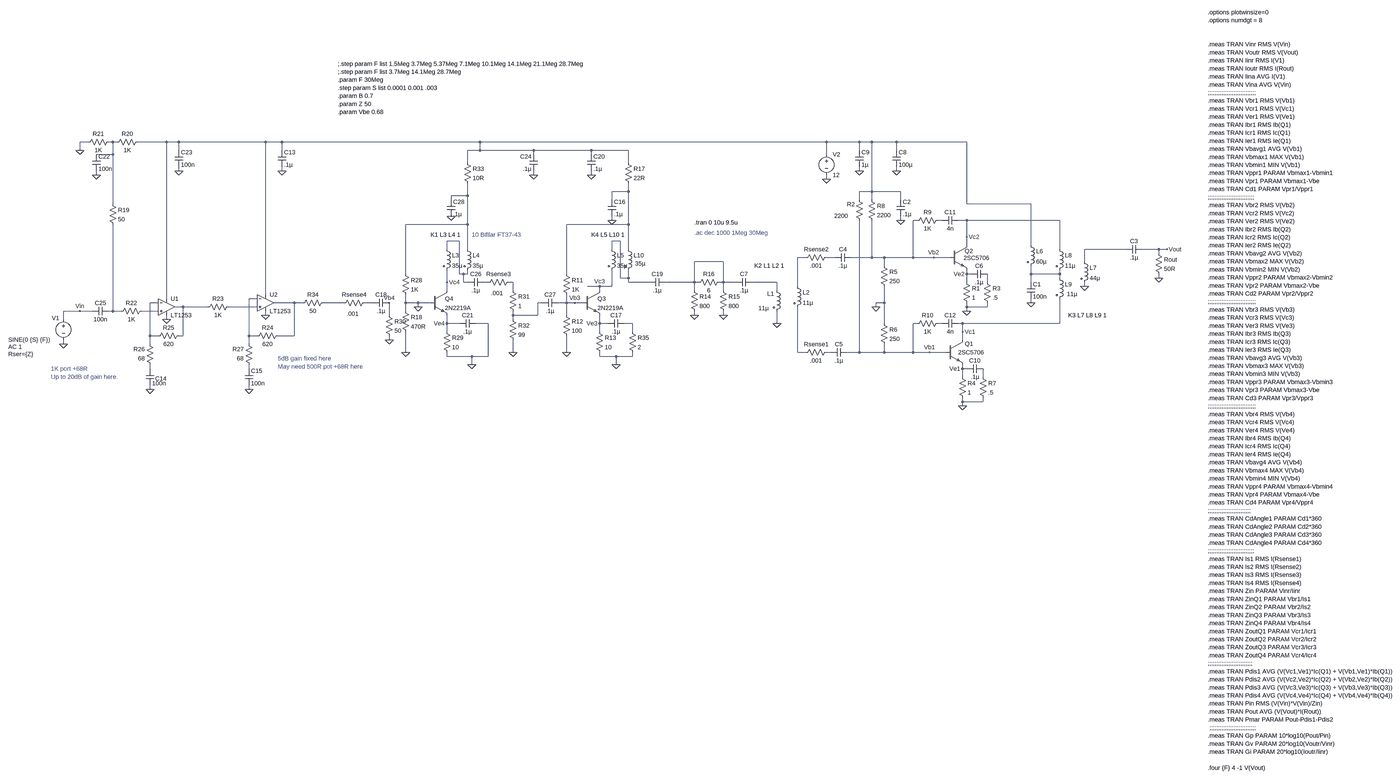
[diagram p0: schematic LT1253+2N3904+2n2219+SC5706 Push-Pull testing.asc, whole sheet]
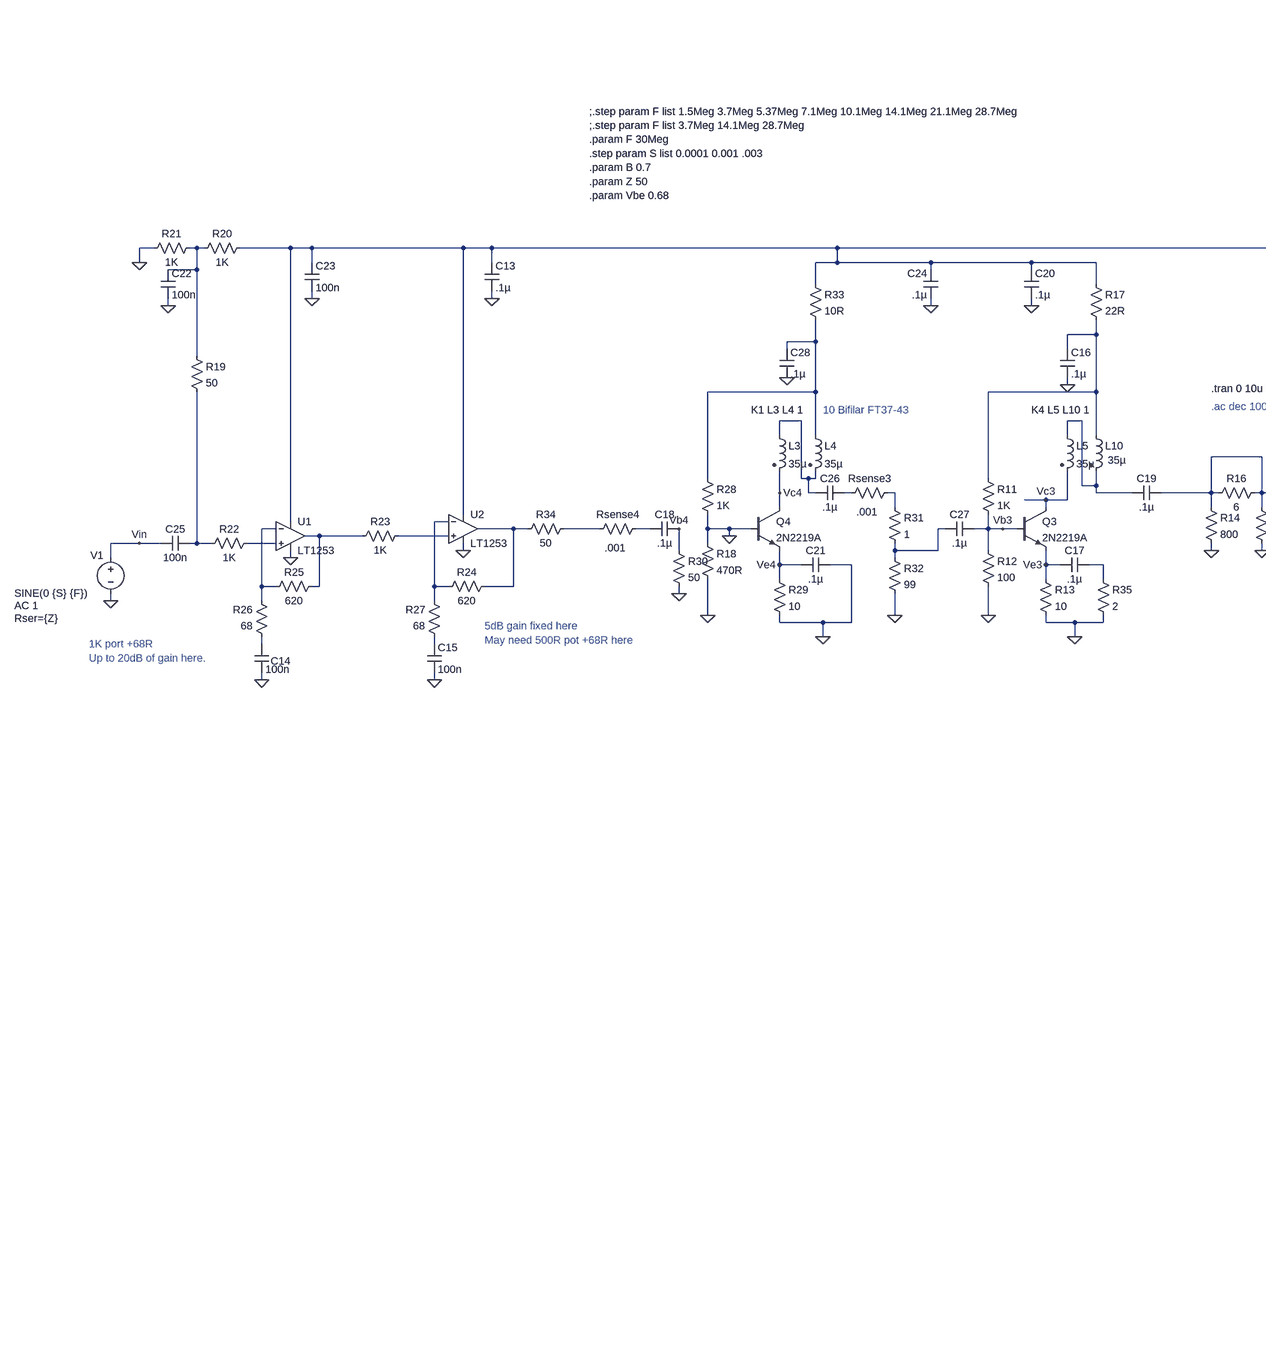
[diagram p1: schematic LT1253+2N3904+2n2219+SC5706 Push-Pull testing.asc, part, row 1 of 1, column 1 of 2]
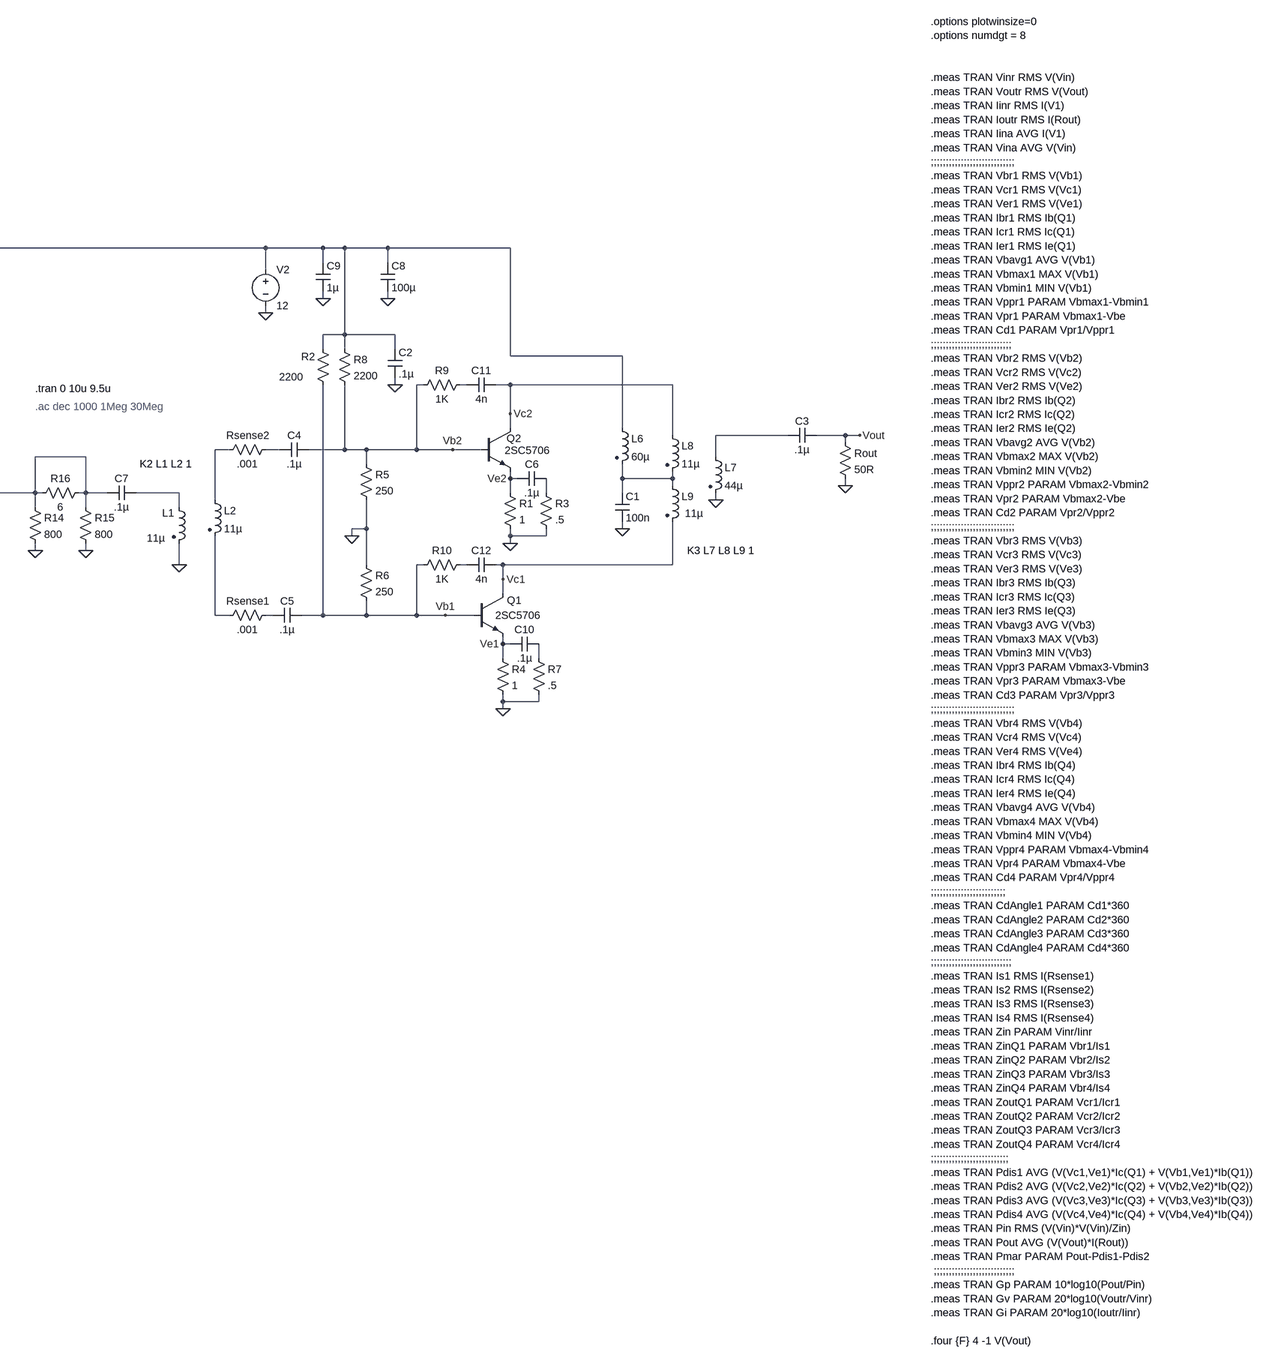
[diagram p2: schematic LT1253+2N3904+2n2219+SC5706 Push-Pull testing.asc, part, row 1 of 1, column 2 of 2]
LT1253+2N3904+2n2219+SC5706 Push-Pull testing.asc, the LTspice schematic file:
Version 4
SHEET 1 3748 1520
WIRE -2704 -624 -2736 -624
WIRE -2608 -624 -2624 -624
WIRE -2592 -624 -2608 -624
WIRE -2400 -624 -2512 -624
WIRE -2352 -624 -2400 -624
WIRE -2016 -624 -2352 -624
WIRE -1952 -624 -2016 -624
WIRE -1184 -624 -1952 -624
WIRE 160 -624 -1184 -624
WIRE 288 -624 160 -624
WIRE 336 -624 288 -624
WIRE 432 -624 336 -624
WIRE 704 -624 432 -624
WIRE -2736 -592 -2736 -624
WIRE -2352 -592 -2352 -624
WIRE -1952 -592 -1952 -624
WIRE -1184 -592 -1184 -624
WIRE -1184 -592 -1232 -592
WIRE -976 -592 -1184 -592
WIRE -752 -592 -976 -592
WIRE -608 -592 -752 -592
WIRE 288 -592 288 -624
WIRE 432 -592 432 -624
WIRE -2608 -576 -2608 -624
WIRE -2608 -576 -2672 -576
WIRE -976 -576 -976 -592
WIRE -752 -576 -752 -592
WIRE 160 -576 160 -624
WIRE -1232 -544 -1232 -592
WIRE -608 -544 -608 -592
WIRE -2352 -512 -2352 -528
WIRE -1952 -512 -1952 -528
WIRE 288 -512 288 -528
WIRE 432 -512 432 -528
WIRE -2672 -496 -2672 -512
WIRE -976 -496 -976 -512
WIRE -752 -496 -752 -512
WIRE 160 -480 160 -496
WIRE -608 -432 -608 -464
WIRE -608 -432 -672 -432
WIRE 336 -432 336 -624
WIRE 336 -432 288 -432
WIRE 448 -432 336 -432
WIRE -1232 -416 -1232 -464
WIRE -1232 -416 -1296 -416
WIRE -1296 -400 -1296 -416
WIRE -672 -400 -672 -432
WIRE 288 -400 288 -432
WIRE 336 -400 336 -432
WIRE 448 -400 448 -432
WIRE -2608 -384 -2608 -576
WIRE 704 -384 704 -624
WIRE 960 -384 704 -384
WIRE -672 -320 -672 -336
WIRE 448 -320 448 -336
WIRE 512 -320 496 -320
WIRE 608 -320 592 -320
WIRE 704 -320 672 -320
WIRE 1072 -320 704 -320
WIRE -1232 -304 -1232 -416
WIRE -1232 -304 -1472 -304
WIRE -608 -304 -608 -432
WIRE -608 -304 -848 -304
WIRE 704 -256 704 -320
WIRE -1264 -240 -1312 -240
WIRE -640 -240 -672 -240
WIRE 704 -224 704 -256
WIRE 960 -224 960 -384
WIRE -1312 -208 -1312 -240
WIRE -1232 -208 -1232 -304
WIRE -672 -208 -672 -240
WIRE -608 -208 -608 -304
WIRE 1072 -208 1072 -320
WIRE 1328 -208 1168 -208
WIRE 1456 -208 1392 -208
WIRE 1488 -208 1456 -208
WIRE 1456 -192 1456 -208
WIRE 80 -176 48 -176
WIRE 192 -176 160 -176
WIRE 336 -176 336 -320
WIRE 336 -176 256 -176
WIRE 384 -176 336 -176
WIRE 496 -176 496 -320
WIRE 496 -176 384 -176
WIRE 576 -176 496 -176
WIRE 640 -176 576 -176
WIRE -240 -160 -352 -160
WIRE 1168 -160 1168 -208
WIRE 384 -144 384 -176
WIRE -1472 -112 -1472 -304
WIRE -1264 -112 -1264 -240
WIRE -1248 -112 -1264 -112
WIRE -1232 -112 -1232 -128
WIRE -1232 -112 -1248 -112
WIRE -848 -112 -848 -304
WIRE 704 -112 704 -128
WIRE 720 -112 704 -112
WIRE 960 -112 960 -144
WIRE 1072 -112 1072 -128
WIRE 1072 -112 960 -112
WIRE -640 -96 -640 -240
WIRE -608 -96 -608 -128
WIRE -608 -96 -640 -96
WIRE 1072 -96 1072 -112
WIRE 1456 -96 1456 -112
WIRE -1312 -80 -1312 -128
WIRE -1248 -80 -1248 -112
WIRE -1232 -80 -1248 -80
WIRE -1152 -80 -1168 -80
WIRE -1056 -80 -1072 -80
WIRE -608 -80 -608 -96
WIRE -528 -80 -608 -80
WIRE -352 -80 -352 -160
WIRE -352 -80 -464 -80
WIRE -336 -80 -352 -80
WIRE -240 -80 -240 -160
WIRE -240 -80 -256 -80
WIRE -192 -80 -240 -80
WIRE -32 -80 -128 -80
WIRE 704 -80 704 -112
WIRE 784 -80 784 -112
WIRE 960 -80 960 -112
WIRE -720 -64 -768 -64
WIRE -672 -64 -672 -128
WIRE -672 -64 -720 -64
WIRE 48 -64 48 -176
WIRE 1168 -64 1168 -80
WIRE -1312 -48 -1312 -80
WIRE -1056 -48 -1056 -80
WIRE -720 -48 -720 -64
WIRE -352 -48 -352 -80
WIRE -240 -48 -240 -80
WIRE -32 -48 -32 -80
WIRE -2016 -32 -2016 -624
WIRE -2400 -16 -2400 -624
WIRE -2048 -16 -2080 -16
WIRE -2432 0 -2464 0
WIRE -1904 0 -1984 0
WIRE -1872 0 -1904 0
WIRE -1712 0 -1792 0
WIRE -1600 0 -1632 0
WIRE -1472 0 -1472 -32
WIRE -1424 0 -1472 0
WIRE -1376 0 -1424 0
WIRE -944 0 -960 0
WIRE -848 0 -848 -32
WIRE -848 0 -880 0
WIRE -816 0 -848 0
WIRE -784 0 -816 0
WIRE 384 0 384 -64
WIRE 384 0 352 0
WIRE 960 0 960 -16
WIRE -2336 16 -2368 16
WIRE -2240 16 -2336 16
WIRE -2048 16 -2160 16
WIRE -1424 16 -1424 0
WIRE 352 16 352 0
WIRE 704 16 704 0
WIRE 784 16 784 0
WIRE 784 16 704 16
WIRE -2736 32 -2800 32
WIRE -2688 32 -2736 32
WIRE -2608 32 -2608 -304
WIRE -2608 32 -2624 32
WIRE -2576 32 -2608 32
WIRE -2432 32 -2496 32
WIRE -1472 32 -1472 0
WIRE 704 32 704 16
WIRE -2016 48 -2016 32
WIRE -1536 48 -1536 0
WIRE -1056 48 -1056 32
WIRE -960 48 -960 0
WIRE -960 48 -1056 48
WIRE -848 48 -848 0
WIRE -352 48 -352 32
WIRE -240 48 -240 32
WIRE -2800 64 -2800 32
WIRE -2400 64 -2400 48
WIRE -1056 64 -1056 48
WIRE -1312 80 -1312 48
WIRE -1264 80 -1312 80
WIRE -1152 80 -1200 80
WIRE -720 80 -720 48
WIRE -688 80 -720 80
WIRE -592 80 -624 80
WIRE -32 80 -32 32
WIRE 384 80 384 0
WIRE 512 80 496 80
WIRE 608 80 592 80
WIRE 688 80 672 80
WIRE 1072 80 1072 -16
WIRE 1072 80 688 80
WIRE -1312 112 -1312 80
WIRE -720 112 -720 80
WIRE -592 112 -592 80
WIRE 688 112 688 80
WIRE -2464 128 -2464 0
WIRE -2432 128 -2464 128
WIRE -2336 128 -2336 16
WIRE -2336 128 -2352 128
WIRE -2080 128 -2080 -16
WIRE -2048 128 -2080 128
WIRE -1904 128 -1904 0
WIRE -1904 128 -1968 128
WIRE -1536 144 -1536 128
WIRE 688 144 688 112
WIRE -2800 160 -2800 144
WIRE -2464 160 -2464 128
WIRE -2080 160 -2080 128
WIRE -1472 192 -1472 112
WIRE -1056 192 -1056 144
WIRE -848 192 -848 128
WIRE 48 192 48 16
WIRE 80 192 48 192
WIRE 176 192 160 192
WIRE 288 192 288 -320
WIRE 288 192 240 192
WIRE 384 192 384 160
WIRE 384 192 288 192
WIRE 496 192 496 80
WIRE 496 192 384 192
WIRE 560 192 496 192
WIRE 624 192 560 192
WIRE -1312 208 -1312 192
WIRE -1216 208 -1312 208
WIRE -1152 208 -1152 80
WIRE -1152 208 -1216 208
WIRE -720 208 -720 192
WIRE -656 208 -720 208
WIRE -592 208 -592 192
WIRE -592 208 -656 208
WIRE -1216 240 -1216 208
WIRE -656 240 -656 208
WIRE -2464 256 -2464 240
WIRE -2080 256 -2080 240
WIRE 688 256 688 240
WIRE 704 256 688 256
WIRE 688 288 688 256
WIRE 768 288 768 256
WIRE -2464 336 -2464 320
WIRE -2080 336 -2080 320
WIRE 688 384 688 368
WIRE 768 384 768 368
WIRE 768 384 688 384
WIRE 688 400 688 384
FLAG 160 -480 0
FLAG -2800 160 0
FLAG 688 400 0
FLAG 1488 -208 Vout
FLAG 1456 -96 0
FLAG 560 192 Vb1
FLAG 688 256 Ve1
FLAG -2736 32 Vin
FLAG 688 112 Vc1
FLAG 704 32 0
FLAG 576 -176 Vb2
FLAG 704 -112 Ve2
FLAG 704 -256 Vc2
FLAG -32 80 0
FLAG 352 16 0
FLAG 960 0 0
FLAG 448 -320 0
FLAG 288 -512 0
FLAG 1168 -64 0
FLAG 432 -512 0
FLAG -1952 -512 0
FLAG -352 48 0
FLAG -240 48 0
FLAG -2352 -512 0
FLAG -2672 -496 0
FLAG -2400 64 0
FLAG -2016 48 0
FLAG -2080 336 0
FLAG -2736 -592 0
FLAG -2464 336 0
FLAG -848 192 0
FLAG -672 -320 0
FLAG -752 -496 0
FLAG -976 -496 0
FLAG -1216 240 0
FLAG -1472 192 0
FLAG -1056 192 0
FLAG -1296 -336 0
FLAG -816 0 Vb3
FLAG -1536 0 Vb4
FLAG -720 -64 Vc3
FLAG -720 80 Ve3
FLAG -1312 -80 Vc4
FLAG -1312 80 Ve4
FLAG -656 240 0
FLAG -1536 144 0
FLAG -1424 16 0
SYMBOL npn 624 144 R0
WINDOW 0 73 15 Left 2
WINDOW 3 47 48 Left 2
SYMATTR InstName Q1
SYMATTR Value 2SC5706
SYMBOL voltage -2800 48 R0
WINDOW 0 -45 11 Left 2
WINDOW 3 -214 95 Left 2
WINDOW 123 -214 123 Left 2
WINDOW 39 -214 151 Left 2
SYMATTR InstName V1
SYMATTR Value SINE(0 {S} {F})
SYMATTR Value2 AC 1
SYMATTR SpiceLine Rser={Z}
SYMBOL voltage 160 -592 R0
WINDOW 123 0 0 Left 0
WINDOW 39 0 0 Left 0
SYMATTR InstName V2
SYMATTR Value 12
SYMBOL res 672 272 R0
SYMATTR InstName R4
SYMATTR Value 1
SYMBOL cap 1392 -224 R90
WINDOW 0 0 32 VBottom 2
WINDOW 3 32 32 VTop 2
SYMATTR InstName C3
SYMATTR Value .1µ
SYMBOL res 1440 -208 R0
SYMATTR InstName Rout
SYMATTR Value 50R
SYMBOL cap -128 -96 R90
WINDOW 0 0 32 VBottom 2
WINDOW 3 32 32 VTop 2
SYMATTR InstName C7
SYMATTR Value .1µ
SYMBOL npn 640 -224 R0
WINDOW 0 56 23 Left 2
WINDOW 3 52 50 Left 2
SYMATTR InstName Q2
SYMATTR Value 2SC5706
SYMBOL res 688 -96 R0
SYMATTR InstName R1
SYMATTR Value 1
SYMBOL ind2 -48 -64 R0
WINDOW 0 -22 29 Left 2
WINDOW 3 -56 85 Left 2
SYMATTR InstName L1
SYMATTR Value 11µ
SYMATTR Type ind
SYMBOL ind2 32 -80 R0
SYMATTR InstName L2
SYMATTR Value 11µ
SYMATTR Type ind
SYMBOL res 320 -416 R0
SYMATTR InstName R8
SYMATTR Value 2200
SYMBOL res 368 -160 R0
SYMATTR InstName R5
SYMATTR Value 250
SYMBOL res 368 64 R0
SYMATTR InstName R6
SYMATTR Value 250
SYMBOL ind2 1056 -224 R0
SYMATTR InstName L8
SYMATTR Value 11µ
SYMATTR Type ind
SYMBOL ind2 1056 -112 R0
WINDOW 3 43 78 Left 2
SYMATTR Value 11µ
SYMATTR InstName L9
SYMATTR Type ind
SYMBOL ind2 1152 -176 R0
SYMATTR InstName L7
SYMATTR Value 44µ
SYMATTR Type ind
SYMBOL ind2 944 -240 R0
SYMATTR InstName L6
SYMATTR Value 60µ
SYMATTR Type ind
SYMBOL cap 944 -80 R0
SYMATTR InstName C1
SYMATTR Value 100n
SYMBOL cap 432 -400 R0
SYMATTR InstName C2
SYMATTR Value .1µ
SYMBOL cap 272 -592 R0
SYMATTR InstName C9
SYMATTR Value 1µ
SYMBOL res 272 -416 R0
WINDOW 0 -33 33 Left 2
WINDOW 3 -82 78 Left 2
SYMATTR InstName R2
SYMATTR Value 2200
SYMBOL cap 416 -592 R0
SYMATTR InstName C8
SYMATTR Value 100µ
SYMBOL res 176 -192 R90
WINDOW 0 0 56 VBottom 2
WINDOW 3 32 56 VTop 2
SYMATTR InstName Rsense2
SYMATTR Value .001
SYMBOL res 176 176 R90
WINDOW 0 0 56 VBottom 2
WINDOW 3 32 56 VTop 2
SYMATTR InstName Rsense1
SYMATTR Value .001
SYMBOL cap 256 -192 R90
WINDOW 0 0 32 VBottom 2
WINDOW 3 32 32 VTop 2
SYMATTR InstName C4
SYMATTR Value .1µ
SYMBOL cap 240 176 R90
WINDOW 0 0 32 VBottom 2
WINDOW 3 32 32 VTop 2
SYMATTR InstName C5
SYMATTR Value .1µ
SYMBOL cap 784 -128 R90
WINDOW 0 0 32 VBottom 2
WINDOW 3 32 32 VTop 2
SYMATTR InstName C6
SYMATTR Value .1µ
SYMBOL cap 768 240 R90
WINDOW 0 0 32 VBottom 2
WINDOW 3 32 32 VTop 2
SYMATTR InstName C10
SYMATTR Value .1µ
SYMBOL res 768 -96 R0
SYMATTR InstName R3
SYMATTR Value .5
SYMBOL res 752 272 R0
SYMATTR InstName R7
SYMATTR Value .5
SYMBOL cap 672 -336 R90
WINDOW 0 0 32 VBottom 2
WINDOW 3 32 32 VTop 2
SYMATTR InstName C11
SYMATTR Value 4n
SYMBOL res 608 -336 R90
WINDOW 0 0 56 VBottom 2
WINDOW 3 32 56 VTop 2
SYMATTR InstName R9
SYMATTR Value 1K
SYMBOL cap 672 64 R90
WINDOW 0 0 32 VBottom 2
WINDOW 3 32 32 VTop 2
SYMATTR InstName C12
SYMATTR Value 4n
SYMBOL res 608 64 R90
WINDOW 0 0 56 VBottom 2
WINDOW 3 32 56 VTop 2
SYMATTR InstName R10
SYMATTR Value 1K
SYMBOL cap -1968 -592 R0
SYMATTR InstName C13
SYMATTR Value .1µ
SYMBOL res -368 -64 R0
SYMATTR InstName R14
SYMATTR Value 800
SYMBOL res -256 -64 R0
SYMATTR InstName R15
SYMATTR Value 800
SYMBOL res -240 -96 R90
WINDOW 0 0 56 VBottom 2
WINDOW 3 32 56 VTop 2
SYMATTR InstName R16
SYMATTR Value 6
SYMBOL cap -464 -96 R90
WINDOW 0 0 32 VBottom 2
WINDOW 3 32 32 VTop 2
SYMATTR InstName C19
SYMATTR Value .1µ
SYMBOL Opamps\\LT1253 -2400 -48 R0
SYMATTR InstName U1
SYMBOL Opamps\\LT1253 -2016 -64 R0
SYMATTR InstName U2
SYMBOL res -2624 -400 R0
SYMATTR InstName R19
SYMATTR Value 50
SYMBOL res -2496 -640 R90
WINDOW 0 0 56 VBottom 2
WINDOW 3 32 56 VTop 2
SYMATTR InstName R20
SYMATTR Value 1K
SYMBOL res -2608 -640 R90
WINDOW 0 0 56 VBottom 2
WINDOW 3 32 56 VTop 2
SYMATTR InstName R21
SYMATTR Value 1K
SYMBOL res -2480 16 R90
WINDOW 0 0 56 VBottom 2
WINDOW 3 32 56 VTop 2
SYMATTR InstName R22
SYMATTR Value 1K
SYMBOL res -2144 0 R90
WINDOW 0 0 56 VBottom 2
WINDOW 3 32 56 VTop 2
SYMATTR InstName R23
SYMATTR Value 1K
SYMBOL res -1952 112 R90
WINDOW 0 0 56 VBottom 2
WINDOW 3 32 56 VTop 2
SYMATTR InstName R24
SYMATTR Value 620
SYMBOL res -2336 112 R90
WINDOW 0 0 56 VBottom 2
WINDOW 3 32 56 VTop 2
SYMATTR InstName R25
SYMATTR Value 620
SYMBOL res -2448 256 R180
WINDOW 0 36 76 Left 2
WINDOW 3 36 40 Left 2
SYMATTR InstName R26
SYMATTR Value 68
SYMBOL res -2064 256 R180
WINDOW 0 36 76 Left 2
WINDOW 3 36 40 Left 2
SYMATTR InstName R27
SYMATTR Value 68
SYMBOL cap -2480 256 R0
WINDOW 0 36 38 Left 2
SYMATTR InstName C14
SYMATTR Value 100n
SYMBOL cap -2096 256 R0
SYMATTR InstName C15
SYMATTR Value 100n
SYMBOL cap -2688 -576 R0
SYMATTR InstName C22
SYMATTR Value 100n
SYMBOL cap -2368 -592 R0
SYMATTR InstName C23
SYMATTR Value 100n
SYMBOL cap -2624 16 R90
WINDOW 0 0 32 VBottom 2
WINDOW 3 32 32 VTop 2
SYMATTR InstName C25
SYMATTR Value 100n
SYMBOL res -1056 -96 R90
WINDOW 0 0 56 VBottom 2
WINDOW 3 43 62 VTop 2
SYMATTR InstName Rsense3
SYMATTR Value .001
SYMBOL npn -784 -48 R0
SYMATTR InstName Q3
SYMATTR Value 2N2219A
SYMBOL res -864 -128 R0
SYMATTR InstName R11
SYMATTR Value 1K
SYMBOL res -864 32 R0
SYMATTR InstName R12
SYMATTR Value 100
SYMBOL res -736 96 R0
SYMATTR InstName R13
SYMATTR Value 10
SYMBOL ind2 -1328 -224 R0
SYMATTR InstName L3
SYMATTR Value 35µ
SYMATTR Type ind
SYMBOL ind2 -1248 -224 R0
SYMATTR InstName L4
SYMATTR Value 35µ
SYMATTR Type ind
SYMBOL res -624 -560 R0
SYMATTR InstName R17
SYMATTR Value 22R
SYMBOL cap -688 -400 R0
SYMATTR InstName C16
SYMATTR Value .1µ
SYMBOL cap -1536 -16 R90
WINDOW 0 0 32 VBottom 2
WINDOW 3 32 32 VTop 2
SYMATTR InstName C18
SYMATTR Value .1µ
SYMBOL ind2 -688 -224 R0
SYMATTR InstName L5
SYMATTR Value 35µ
SYMATTR Type ind
SYMBOL ind2 -624 -224 R0
WINDOW 3 42 71 Left 2
SYMATTR Value 35µ
SYMATTR InstName L10
SYMATTR Type ind
SYMBOL cap -768 -576 R0
SYMATTR InstName C20
SYMATTR Value .1µ
SYMBOL npn -1376 -48 R0
SYMATTR InstName Q4
SYMATTR Value 2N2219A
SYMBOL res -1488 16 R0
SYMATTR InstName R18
SYMATTR Value 470R
SYMBOL res -1488 -128 R0
SYMATTR InstName R28
SYMATTR Value 1K
SYMBOL res -1328 96 R0
SYMATTR InstName R29
SYMATTR Value 10
SYMBOL cap -1200 64 R90
WINDOW 0 0 32 VBottom 2
WINDOW 3 32 32 VTop 2
SYMATTR InstName C21
SYMATTR Value .1µ
SYMBOL cap -960 -512 R180
WINDOW 0 24 56 Left 2
WINDOW 3 24 8 Left 2
SYMATTR InstName C24
SYMATTR Value .1µ
SYMBOL cap -1232 -64 R270
WINDOW 0 32 32 VTop 2
WINDOW 3 0 32 VBottom 2
SYMATTR InstName C26
SYMATTR Value .1µ
SYMBOL res -1072 -64 R0
SYMATTR InstName R31
SYMATTR Value 1
SYMBOL res -1072 48 R0
SYMATTR InstName R32
SYMATTR Value 99
SYMBOL res -1248 -560 R0
SYMATTR InstName R33
SYMATTR Value 10R
SYMBOL cap -944 16 R270
WINDOW 0 32 32 VTop 2
WINDOW 3 0 32 VBottom 2
SYMATTR InstName C27
SYMATTR Value .1µ
SYMBOL cap -1312 -400 R0
SYMATTR InstName C28
SYMATTR Value .1µ
SYMBOL res -1776 -16 R90
WINDOW 0 0 56 VBottom 2
WINDOW 3 32 56 VTop 2
SYMATTR InstName R34
SYMATTR Value 50
SYMBOL res -608 96 R0
SYMATTR InstName R35
SYMATTR Value 2
SYMBOL cap -624 64 R90
WINDOW 0 0 32 VBottom 2
WINDOW 3 32 32 VTop 2
SYMATTR InstName C17
SYMATTR Value .1µ
SYMBOL res -1616 -16 R90
WINDOW 0 0 56 VBottom 2
WINDOW 3 43 62 VTop 2
SYMATTR InstName Rsense4
SYMATTR Value .001
SYMBOL res -1552 32 R0
SYMATTR InstName R30
SYMATTR Value 50
TEXT -352 -312 Left 2 !.tran 0 10u 9.5u
TEXT 1864 -1128 Left 2 !.options plotwinsize=0\n.options numdgt = 8\n \n \n.meas TRAN Vinr RMS V(Vin)\n.meas TRAN Voutr RMS V(Vout)\n.meas TRAN Iinr RMS I(V1)\n.meas TRAN Ioutr RMS I(Rout)\n.meas TRAN Iina AVG I(V1)\n.meas TRAN Vina AVG V(Vin)\n;;;;;;;;;;;;;;;;;;;;;;;;;;;;\n.meas TRAN Vbr1 RMS V(Vb1)\n.meas TRAN Vcr1 RMS V(Vc1)\n.meas TRAN Ver1 RMS V(Ve1)\n.meas TRAN Ibr1 RMS Ib(Q1)\n.meas TRAN Icr1 RMS Ic(Q1)\n.meas TRAN Ier1 RMS Ie(Q1)\n.meas TRAN Vbavg1 AVG V(Vb1)\n.meas TRAN Vbmax1 MAX V(Vb1)\n.meas TRAN Vbmin1 MIN V(Vb1)\n.meas TRAN Vppr1 PARAM Vbmax1-Vbmin1\n.meas TRAN Vpr1 PARAM Vbmax1-Vbe\n.meas TRAN Cd1 PARAM Vpr1/Vppr1\n;;;;;;;;;;;;;;;;;;;;;;;;;;;\n.meas TRAN Vbr2 RMS V(Vb2)\n.meas TRAN Vcr2 RMS V(Vc2)\n.meas TRAN Ver2 RMS V(Ve2)\n.meas TRAN Ibr2 RMS Ib(Q2)\n.meas TRAN Icr2 RMS Ic(Q2)\n.meas TRAN Ier2 RMS Ie(Q2)\n.meas TRAN Vbavg2 AVG V(Vb2)\n.meas TRAN Vbmax2 MAX V(Vb2)\n.meas TRAN Vbmin2 MIN V(Vb2)\n.meas TRAN Vppr2 PARAM Vbmax2-Vbmin2\n.meas TRAN Vpr2 PARAM Vbmax2-Vbe\n.meas TRAN Cd2 PARAM Vpr2/Vppr2\n;;;;;;;;;;;;;;;;;;;;;;;;;;;;\n.meas TRAN Vbr3 RMS V(Vb3)\n.meas TRAN Vcr3 RMS V(Vc3)\n.meas TRAN Ver3 RMS V(Ve3)\n.meas TRAN Ibr3 RMS Ib(Q3)\n.meas TRAN Icr3 RMS Ic(Q3)\n.meas TRAN Ier3 RMS Ie(Q3)\n.meas TRAN Vbavg3 AVG V(Vb3)\n.meas TRAN Vbmax3 MAX V(Vb3)\n.meas TRAN Vbmin3 MIN V(Vb3)\n.meas TRAN Vppr3 PARAM Vbmax3-Vbmin3\n.meas TRAN Vpr3 PARAM Vbmax3-Vbe\n.meas TRAN Cd3 PARAM Vpr3/Vppr3\n;;;;;;;;;;;;;;;;;;;;;;;;;;;;\n.meas TRAN Vbr4 RMS V(Vb4)\n.meas TRAN Vcr4 RMS V(Vc4)\n.meas TRAN Ver4 RMS V(Ve4)\n.meas TRAN Ibr4 RMS Ib(Q4)\n.meas TRAN Icr4 RMS Ic(Q4)\n.meas TRAN Ier4 RMS Ie(Q4)\n.meas TRAN Vbavg4 AVG V(Vb4)\n.meas TRAN Vbmax4 MAX V(Vb4)\n.meas TRAN Vbmin4 MIN V(Vb4)\n.meas TRAN Vppr4 PARAM Vbmax4-Vbmin4\n.meas TRAN Vpr4 PARAM Vbmax4-Vbe\n.meas TRAN Cd4 PARAM Vpr4/Vppr4\n;;;;;;;;;;;;;;;;;;;;;;;;;\n.meas TRAN CdAngle1 PARAM Cd1*360\n.meas TRAN CdAngle2 PARAM Cd2*360\n.meas TRAN CdAngle3 PARAM Cd3*360\n.meas TRAN CdAngle4 PARAM Cd4*360\n;;;;;;;;;;;;;;;;;;;;;;;;;;;\n.meas TRAN Is1 RMS I(Rsense1)\n.meas TRAN Is2 RMS I(Rsense2)\n.meas TRAN Is3 RMS I(Rsense3)\n.meas TRAN Is4 RMS I(Rsense4)\n.meas TRAN Zin PARAM Vinr/Iinr\n.meas TRAN ZinQ1 PARAM Vbr1/Is1\n.meas TRAN ZinQ2 PARAM Vbr2/Is2 \n.meas TRAN ZinQ3 PARAM Vbr3/Is3 \n.meas TRAN ZinQ4 PARAM Vbr4/Is4 \n.meas TRAN ZoutQ1 PARAM Vcr1/Icr1\n.meas TRAN ZoutQ2 PARAM Vcr2/Icr2\n.meas TRAN ZoutQ3 PARAM Vcr3/Icr3\n.meas TRAN ZoutQ4 PARAM Vcr4/Icr4\n;;;;;;;;;;;;;;;;;;;;;;;;;;\n.meas TRAN Pdis1 AVG (V(Vc1,Ve1)*Ic(Q1) + V(Vb1,Ve1)*Ib(Q1))\n.meas TRAN Pdis2 AVG (V(Vc2,Ve2)*Ic(Q2) + V(Vb2,Ve2)*Ib(Q2))\n.meas TRAN Pdis3 AVG (V(Vc3,Ve3)*Ic(Q3) + V(Vb3,Ve3)*Ib(Q3))\n.meas TRAN Pdis4 AVG (V(Vc4,Ve4)*Ic(Q4) + V(Vb4,Ve4)*Ib(Q4))\n.meas TRAN Pin RMS (V(Vin)*V(Vin)/Zin)\n.meas TRAN Pout AVG (V(Vout)*I(Rout))\n.meas TRAN Pmar PARAM Pout-Pdis1-Pdis2\n ;;;;;;;;;;;;;;;;;;;;;;;;;;;\n.meas TRAN Gp PARAM 10*log10(Pout/Pin)\n.meas TRAN Gv PARAM 20*log10(Voutr/Vinr)\n.meas TRAN Gi PARAM 20*log10(Ioutr/Iinr)\n \n.four {F} 4 -1 V(Vout)
TEXT -1736 -928 Left 2 !;.step param F list 1.5Meg 3.7Meg 5.37Meg 7.1Meg 10.1Meg 14.1Meg 21.1Meg 28.7Meg\n;.step param F list 3.7Meg 14.1Meg 28.7Meg\n.param F 30Meg\n.step param S list 0.0001 0.001 .003\n.param B 0.7\n.param Z 50\n.param Vbe 0.68
TEXT -352 -272 Left 2 ;.ac dec 1000 1Meg 30Meg
TEXT 1104 48 Left 2 !K3 L7 L8 L9 1
TEXT -120 -144 Left 2 !K2 L1 L2 1
TEXT -1968 216 Left 2 ;5dB gain fixed here\nMay need 500R pot +68R here
TEXT -2848 256 Left 2 ;1K port +68R  \nUp to 20dB of gain here.
TEXT -1376 -264 Left 2 !K1 L3 L4 1
TEXT -752 -264 Left 2 !K4 L5 L10 1
TEXT -1216 -264 Left 2 ;10 Bifilar FT37-43

The netlist it stands for:
* LT1253+2N3904+2n2219+SC5706 Push-Pull testing.asc
Q1 Vc1 Vb1 Ve1 0 2SC5706
V1 Vin 0 SINE(0 {S} {F}) AC 1 Rser={Z}
V2 N002 0 12
R4 Ve1 0 1
C3 Vout N008 .1µ
Rout Vout 0 50R
C7 N015 N011 .1µ
Q2 Vc2 Vb2 Ve2 0 2SC5706
R1 Ve2 0 1
L1 N015 0 11µ
L2 N009 N029 11µ
R8 N002 Vb2 2200
R5 Vb2 0 250
R6 0 Vb1 250
L8 Vc2 N012 11µ
L9 N012 Vc1 11µ
L7 N008 0 44µ
L6 N002 N012 60µ
C1 N012 0 100n
C2 N002 0 .1µ
C9 N002 0 1µ
R2 N002 Vb1 2200
C8 N002 0 100µ
Rsense2 N010 N009 .001
Rsense1 N030 N029 .001
C4 Vb2 N010 .1µ
C5 Vb1 N030 .1µ
C6 N016 Ve2 .1µ
C10 N033 Ve1 .1µ
R3 N016 0 .5
R7 N033 0 .5
C11 Vc2 N005 4n
R9 N005 Vb2 1K
C12 Vc1 N028 4n
R10 N028 Vb1 1K
C13 N002 0 .1µ
R14 N011 0 800
R15 N011 0 800
R16 N011 N011 6
C19 N011 N007 .1µ
XU1 N026 N018 N002 0 N023 LT1253  ; pins In+ In- V+ V- OUT
XU2 N024 N017 N002 0 N019 LT1253  ; pins In+ In- V+ V- OUT
R19 N001 N025 50
R20 N002 N001 1K
R21 N001 0 1K
R22 N026 N025 1K
R23 N024 N023 1K
R24 N019 N017 620
R25 N023 N018 620
R26 N031 N018 68
R27 N032 N017 68
C14 N031 0 100n
C15 N032 0 100n
C22 N001 0 100n
C23 N002 0 100n
C25 N025 Vin 100n
Rsense3 N014 N013 .001
Q3 Vc3 Vb3 Ve3 0 2N2219A
R11 N003 Vb3 1K
R12 Vb3 0 100
R13 Ve3 0 10
L3 N006 Vc4 35µ
L4 N004 N006 35µ
R17 N002 N003 22R
C16 N003 0 .1µ
C18 Vb4 N021 .1µ
L5 N007 Vc3 35µ
L10 N003 N007 35µ
C20 N002 0 .1µ
Q4 Vc4 0 Ve4 0 2N2219A
R18 0 0 470R
R28 N004 0 1K
R29 Ve4 0 10
C21 0 Ve4 .1µ
C24 0 N002 .1µ
C26 N006 N013 .1µ
R31 N014 N022 1
R32 N022 0 99
R33 N002 N004 10R
C27 N022 Vb3 .1µ
C28 N004 0 .1µ
R34 N020 N019 50
R35 N027 0 2
C17 N027 Ve3 .1µ
Rsense4 N021 N020 .001
R30 Vb4 0 50
.model NPN NPN
.model PNP PNP
.lib standard.bjt
.tran 0 10u 9.5u
.options plotwinsize=0
.options numdgt = 8
.meas TRAN Vinr RMS V(Vin)
.meas TRAN Voutr RMS V(Vout)
.meas TRAN Iinr RMS I(V1)
.meas TRAN Ioutr RMS I(Rout)
.meas TRAN Iina AVG I(V1)
.meas TRAN Vina AVG V(Vin)
;;;;;;;;;;;;;;;;;;;;;;;;;;;;
.meas TRAN Vbr1 RMS V(Vb1)
.meas TRAN Vcr1 RMS V(Vc1)
.meas TRAN Ver1 RMS V(Ve1)
.meas TRAN Ibr1 RMS Ib(Q1)
.meas TRAN Icr1 RMS Ic(Q1)
.meas TRAN Ier1 RMS Ie(Q1)
.meas TRAN Vbavg1 AVG V(Vb1)
.meas TRAN Vbmax1 MAX V(Vb1)
.meas TRAN Vbmin1 MIN V(Vb1)
.meas TRAN Vppr1 PARAM Vbmax1-Vbmin1
.meas TRAN Vpr1 PARAM Vbmax1-Vbe
.meas TRAN Cd1 PARAM Vpr1/Vppr1
;;;;;;;;;;;;;;;;;;;;;;;;;;;
.meas TRAN Vbr2 RMS V(Vb2)
.meas TRAN Vcr2 RMS V(Vc2)
.meas TRAN Ver2 RMS V(Ve2)
.meas TRAN Ibr2 RMS Ib(Q2)
.meas TRAN Icr2 RMS Ic(Q2)
.meas TRAN Ier2 RMS Ie(Q2)
.meas TRAN Vbavg2 AVG V(Vb2)
.meas TRAN Vbmax2 MAX V(Vb2)
.meas TRAN Vbmin2 MIN V(Vb2)
.meas TRAN Vppr2 PARAM Vbmax2-Vbmin2
.meas TRAN Vpr2 PARAM Vbmax2-Vbe
.meas TRAN Cd2 PARAM Vpr2/Vppr2
;;;;;;;;;;;;;;;;;;;;;;;;;;;;
.meas TRAN Vbr3 RMS V(Vb3)
.meas TRAN Vcr3 RMS V(Vc3)
.meas TRAN Ver3 RMS V(Ve3)
.meas TRAN Ibr3 RMS Ib(Q3)
.meas TRAN Icr3 RMS Ic(Q3)
.meas TRAN Ier3 RMS Ie(Q3)
.meas TRAN Vbavg3 AVG V(Vb3)
.meas TRAN Vbmax3 MAX V(Vb3)
.meas TRAN Vbmin3 MIN V(Vb3)
.meas TRAN Vppr3 PARAM Vbmax3-Vbmin3
.meas TRAN Vpr3 PARAM Vbmax3-Vbe
.meas TRAN Cd3 PARAM Vpr3/Vppr3
;;;;;;;;;;;;;;;;;;;;;;;;;;;;
.meas TRAN Vbr4 RMS V(Vb4)
.meas TRAN Vcr4 RMS V(Vc4)
.meas TRAN Ver4 RMS V(Ve4)
.meas TRAN Ibr4 RMS Ib(Q4)
.meas TRAN Icr4 RMS Ic(Q4)
.meas TRAN Ier4 RMS Ie(Q4)
.meas TRAN Vbavg4 AVG V(Vb4)
.meas TRAN Vbmax4 MAX V(Vb4)
.meas TRAN Vbmin4 MIN V(Vb4)
.meas TRAN Vppr4 PARAM Vbmax4-Vbmin4
.meas TRAN Vpr4 PARAM Vbmax4-Vbe
.meas TRAN Cd4 PARAM Vpr4/Vppr4
;;;;;;;;;;;;;;;;;;;;;;;;;
.meas TRAN CdAngle1 PARAM Cd1*360
.meas TRAN CdAngle2 PARAM Cd2*360
.meas TRAN CdAngle3 PARAM Cd3*360
.meas TRAN CdAngle4 PARAM Cd4*360
;;;;;;;;;;;;;;;;;;;;;;;;;;;
.meas TRAN Is1 RMS I(Rsense1)
.meas TRAN Is2 RMS I(Rsense2)
.meas TRAN Is3 RMS I(Rsense3)
.meas TRAN Is4 RMS I(Rsense4)
.meas TRAN Zin PARAM Vinr/Iinr
.meas TRAN ZinQ1 PARAM Vbr1/Is1
.meas TRAN ZinQ2 PARAM Vbr2/Is2
.meas TRAN ZinQ3 PARAM Vbr3/Is3
.meas TRAN ZinQ4 PARAM Vbr4/Is4
.meas TRAN ZoutQ1 PARAM Vcr1/Icr1
.meas TRAN ZoutQ2 PARAM Vcr2/Icr2
.meas TRAN ZoutQ3 PARAM Vcr3/Icr3
.meas TRAN ZoutQ4 PARAM Vcr4/Icr4
;;;;;;;;;;;;;;;;;;;;;;;;;;
.meas TRAN Pdis1 AVG (V(Vc1,Ve1)*Ic(Q1) + V(Vb1,Ve1)*Ib(Q1))
.meas TRAN Pdis2 AVG (V(Vc2,Ve2)*Ic(Q2) + V(Vb2,Ve2)*Ib(Q2))
.meas TRAN Pdis3 AVG (V(Vc3,Ve3)*Ic(Q3) + V(Vb3,Ve3)*Ib(Q3))
.meas TRAN Pdis4 AVG (V(Vc4,Ve4)*Ic(Q4) + V(Vb4,Ve4)*Ib(Q4))
.meas TRAN Pin RMS (V(Vin)*V(Vin)/Zin)
.meas TRAN Pout AVG (V(Vout)*I(Rout))
.meas TRAN Pmar PARAM Pout-Pdis1-Pdis2
 ;;;;;;;;;;;;;;;;;;;;;;;;;;;
.meas TRAN Gp PARAM 10*log10(Pout/Pin)
.meas TRAN Gv PARAM 20*log10(Voutr/Vinr)
.meas TRAN Gi PARAM 20*log10(Ioutr/Iinr)
.four {F} 4 -1 V(Vout)
;.step param F list 1.5Meg 3.7Meg 5.37Meg 7.1Meg 10.1Meg 14.1Meg 21.1Meg 28.7Meg
;.step param F list 3.7Meg 14.1Meg 28.7Meg
.param F 30Meg
.step param S list 0.0001 0.001 .003
.param B 0.7
.param Z 50
.param Vbe 0.68
* .ac dec 1000 1Meg 30Meg
K3 L7 L8 L9 1
K2 L1 L2 1
* 5dB gain fixed here
* May need 500R pot +68R here
* 1K port +68R
* Up to 20dB of gain here.
K1 L3 L4 1
K4 L5 L10 1
* 10 Bifilar FT37-43
.backanno
.end